# Altium schematic sheet FrontPanel.SchDoc
size A4; CompanyName: Technische Hochschule Nürnberg Georg Simon Ohm; Organization: UltraZohm; Address1: Kesslerplatz 12; Address2: 90489 Nürnberg; Address3: GERMANY; SheetNumber: 24; SheetTotal: 36; Website: www.ultrazohm.com
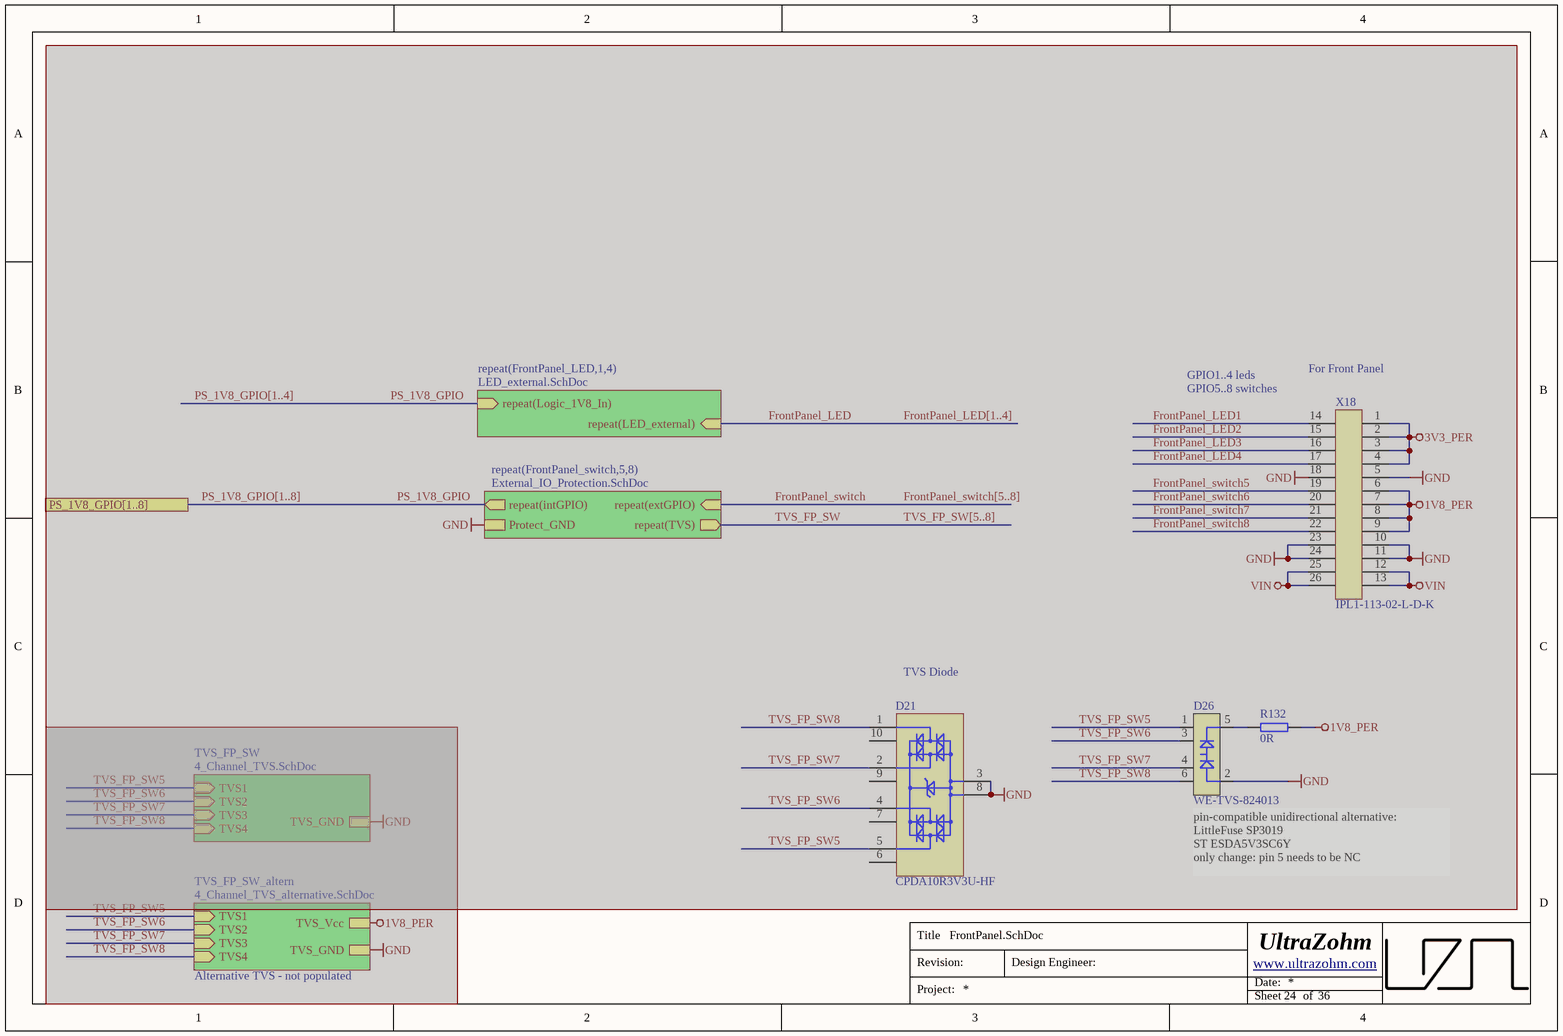
[diagram p0: FrontPanel.SchDoc]

## Parts
D21  CPDA10R3V3U-HF  [DFN230X100X55X10N]  (masked out: inside a compile mask, not in the netlist)
D26  WE-TVS-824013  [SOT95P280X145-6N]  (masked out: inside a compile mask, not in the netlist)
R132  0R  [R_0603_TE]  (masked out: inside a compile mask, not in the netlist)
X18  IPL1-113-02-L-D-K  [IPL1-113-02-L-D-K]  (masked out: inside a compile mask, not in the netlist)

## Sub-sheets
repeat(FrontPanel_LED,1,4) = LED_external.SchDoc (masked out): repeat(LED_external) (in), repeat(Logic_1V8_In) (in)
repeat(FrontPanel_switch,5,8) = External_IO_Protection.SchDoc (masked out): repeat(extGPIO) (in), repeat(intGPIO) (out), repeat(TVS) (out), Protect_GND
TVS_FP_SW = 4_Channel_TVS.SchDoc (masked out): TVS_GND, TVS1 (in), TVS2 (in), TVS3 (in), TVS4 (in)
TVS_FP_SW_altern = 4_Channel_TVS_alternative.SchDoc (masked out): TVS_GND, TVS1 (in), TVS2 (in), TVS3 (in), TVS4 (in), TVS_Vcc

## Ports
PS_1V8_GPIO[1..8]

## Notes on the sheet
- GPIO1..4 leds
- (near X18) For Front Panel
- (near X18) GPIO5..8 switches
- (near D21) TVS Diode
- (near D26) pin-compatible unidirectional alternative:
  LittleFuse SP3019
  ST ESDA5V3SC6Y
  only change: pin 5 needs to be NC
- Alternative TVS - not populated
- Title
- Revision:
- Design Engineer:
- Date:
- Project:
- Sheet
- of

## Library data of the parts
D21 = 29054: AN: 29054; Voltage: 3.3V; Mixed: SMT; Temperature-Range: -55/+125; Extra: Diode Array TVS Diode ESD Protection 4-channel; Case: TSLP-9-1; HelpURL: b:\AD\adlib\datasheet\CPDA10R3V3U-HF\; H-ART: CPDA10R3V3U-HF
D26 = 23986: TVS/Clamp Diode Array 3.3/9V Quad SOT23-6; AN: 23986; Mixed: SMT; Trenz-Stock: Yes; H-ART: 824013; Extra: ESD Protection for 4 lines, Low capacitance; Case: SOT23-6; HelpURL: B:\AD\adlib\datasheet\WE-TVS-824013; Preferred: Yes
R132 = UZgen_R_0603_0R: Generic resistor; Manufacturer: UZgen; Tolerance: 1 %; Created from: UZgenTool; Value: 0R; Manufacturer Part Number: UZgen_R_0603_0R; PartID: 581; Created On: 08.07.2024 14:34:30; Device Package: 0603; Mounting Type: SMD; Last Updated: 08.07.2024 14:34:30
X18 = 30828: AN: 30828; Mixed: SMT; Temperature-Range: -55/+125; Extra: Connector Header IPL1, 2-row 26pos, key polarization, SMT 0°; Case: IPL1; HelpURL: b:\AD\adlib\datasheet\Samtec\IPL1-SMT\; H-ART: IPL1-113-02-L-D-K